# EAGLE design WalkerStalkerv3.0 (EAGLE 7.2.0)
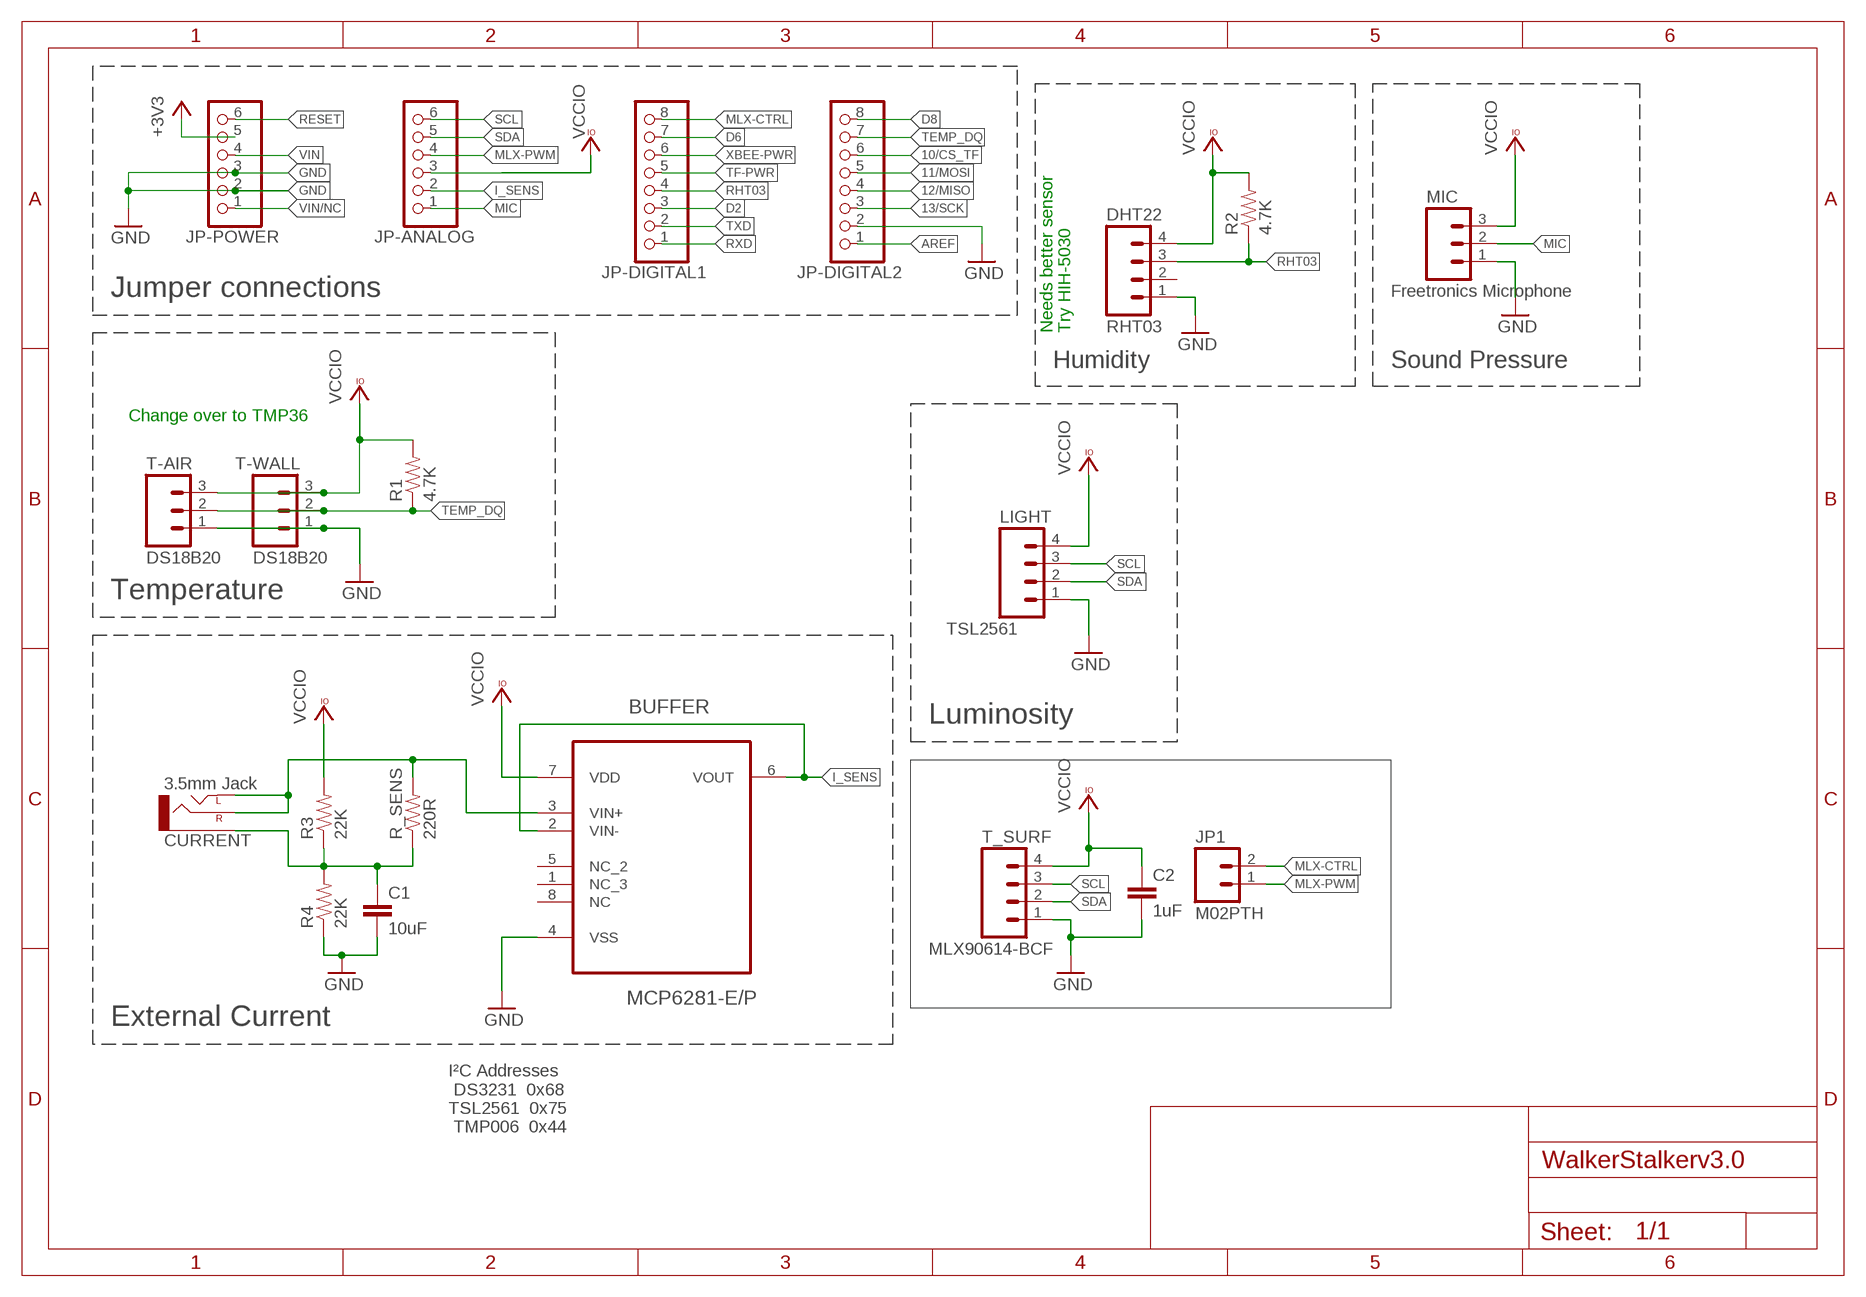
[diagram p0: schematic, sheet 1, part 1 of 2]
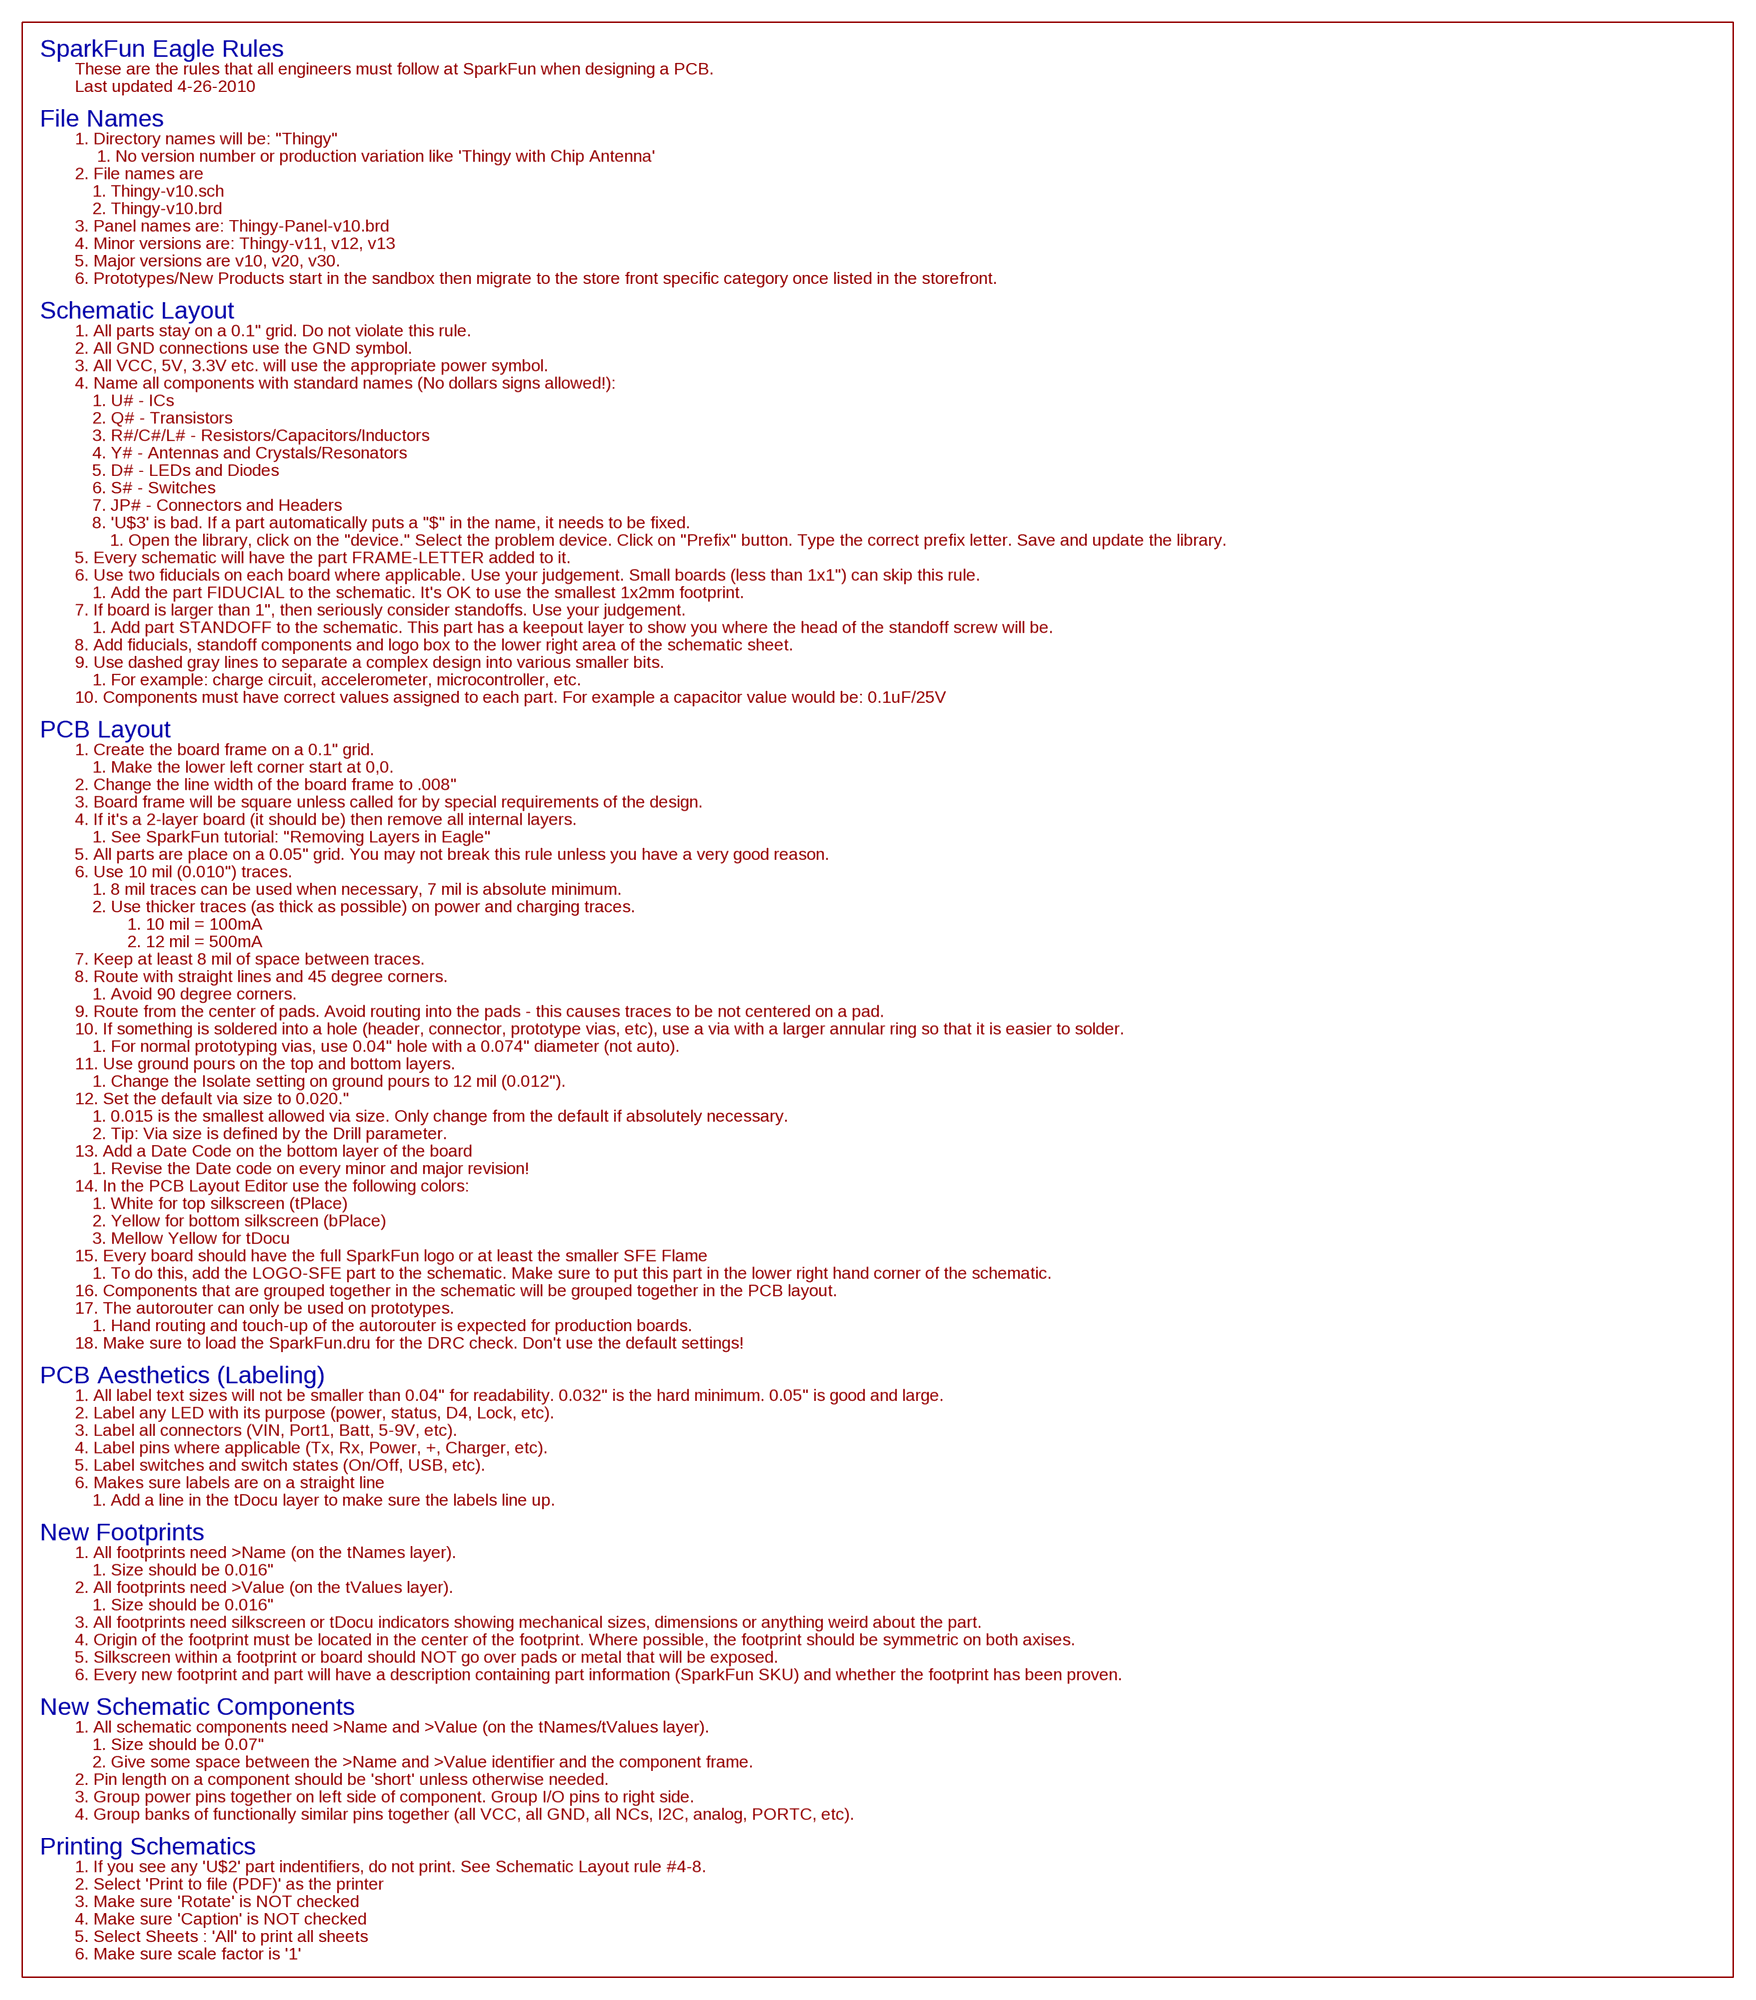
[diagram p1: schematic, sheet 1, part 2 of 2]

## Parts
BUFFER  MCP6281-E/P  [DIP254P762X432-8]
C1  10uF  CAP1206  [1206]
C2  1uF  CAP1206  [1206]
CURRENT  3.5mm Jack  AUDIO-JACKPTH  [AUDIO-JACK]
DHT22  RHT03  M04PTH  [1X04]
JP1  M02PTH  [1X02]
JP-ANALOG  PINHD-1X6CB  [1X06-CLEANBIG]
JP-DIGITAL1  PINHD-1X8CLEANBIG  [1X08-CLEANBIG]
JP-DIGITAL2  PINHD-1X8CLEANBIG  [1X08-CLEANBIG]
JP-POWER  PINHD-1X6CB  [1X06-CLEANBIG]
LIGHT  TSL2561  M04PTH  [1X04]
MIC  Freetronics Microphone  M03PTH  [1X03]
R1  4.7K  RESISTOR1206  [1206]
R2  4.7K  RESISTOR1206  [1206]
R3  22K  RESISTOR1206  [1206]
R4  22K  RESISTOR1206  [1206]
R_SENS  220R  RESISTOR1206  [1206]
T-AIR  DS18B20  M03PTH  [1X03]
T-WALL  DS18B20  M03PTH  [1X03]
T_SURF  MLX90614-BCF  M04PTH  [1X04]

## Nets
10/CS_TF: JP-DIGITAL2.6
11/MOSI: JP-DIGITAL2.5
12/MISO: JP-DIGITAL2.4
13/SCK: JP-DIGITAL2.3
+3V3: JP-POWER.5
AREF: JP-DIGITAL2.1
D2: JP-DIGITAL1.3
D6: JP-DIGITAL1.7
D8: JP-DIGITAL2.8
GND: BUFFER.4(VSS) C1.2 C2.2 DHT22.1 JP-DIGITAL2.2 JP-POWER.2 JP-POWER.3 LIGHT.1 MIC.1 R4.1 T-AIR.1 T-WALL.1 T_SURF.1
I_SENS: BUFFER.2(VIN-) BUFFER.6(VOUT) JP-ANALOG.2
MIC: JP-ANALOG.1 MIC.2
MLX-CTRL: JP1.2 JP-DIGITAL1.8
MLX-PWM: JP1.1 JP-ANALOG.4
N$1: BUFFER.3(VIN+) CURRENT.RING(RIGHT) CURRENT.TIP(LEFT) R_SENS.2
N$2: C1.1 CURRENT.SLEEVE R3.1 R4.2 R_SENS.1
RESET: JP-POWER.6
RHT03: DHT22.3 JP-DIGITAL1.4 R2.1
RXD: JP-DIGITAL1.1
SCL: JP-ANALOG.6 LIGHT.3 T_SURF.3
SDA: JP-ANALOG.5 LIGHT.2 T_SURF.2
TEMP_DQ: JP-DIGITAL2.7 R1.1 T-AIR.2 T-WALL.2
TF-PWR: JP-DIGITAL1.5
TXD: JP-DIGITAL1.2
VCCIO: BUFFER.7(VDD) C2.1 DHT22.4 JP-ANALOG.3 LIGHT.4 MIC.3 R1.2 R2.2 R3.2 T-AIR.3 T-WALL.3 T_SURF.4
VIN: JP-POWER.4
VIN/NC: JP-POWER.1
XBEE-PWR: JP-DIGITAL1.6
Unconnected: BUFFER.1(NC_3) BUFFER.5(NC_2) BUFFER.8(NC) DHT22.2

## Notes on the sheet
- Jumper connections
- Needs better sensor | Try HIH-5030
- Humidity | Sound Pressure
- Change over to TMP36
- Temperature
- Luminosity
- External Current
- I²C Addresses 
   DS3231  0x68
  TSL2561  0x75
   TMP006  0x44

## Library data of the parts
BUFFER = Microchip_By_element14_Batch_1:MCP6281-E/P: Rail-to-Rail Op Amp; DESCRIPTION: OP AMP; MPN: MCP6281-E/P; OC_FARNELL: 1439456; OC_NEWARK: -; PACKAGE: DIP-8; SUPPLIER: Microchip
C1 C2 = SparkFun-Capacitors:CAP: Capacitor Standard 0603 ceramic capacitor, and 0.1" leaded capacitor.
CURRENT = SparkFun-Connectors:AUDIO-JACK: 3.5mm Audio Jack Simple 3.5mm common PCB mount audio jack. SKU: PRT-08032
DHT22 LIGHT T_SURF = SparkFun-Connectors:M04: Header 4 Standard 4-pin 0.1" header. Use with straight break away headers (SKU : PRT-00116), right angle break away headers (PRT-00553), swiss pins (PRT-00743), machine pins (PRT-00117), and female headers (PRT-00115). Molex polarized connector foot print use with SKU : PRT-08231 with associated crimp pins and housings. 1MM SMD Version SKU: PRT-10208
JP1 = SparkFun-Connectors:M02: Standard 2-pin 0.1" header. Use with - straight break away headers ( PRT-00116) - right angle break away headers (PRT-00553) - swiss pins (PRT-00743) - machine pins (PRT-00117) - female headers (PRT-00115) Molex polarized connector foot print use with: PRT-08233 with associated crimp pins and housings. 2.54_SCREWTERM for use with PRT-10571. 3.5mm Screw Terminal footprints for PRT-08084 5mm Screw Terminal footprints for use with PRT-08432
JP-ANALOG JP-POWER = carduino:PINHD-1X6: PIN HEADER
JP-DIGITAL1 JP-DIGITAL2 = carduino:PINHD-1X8: PIN HEADER
MIC T-AIR T-WALL = SparkFun-Connectors:M03: Header 3 Standard 3-pin 0.1" header. Use with straight break away headers (SKU : PRT-00116), right angle break away headers (PRT-00553), swiss pins (PRT-00743), machine pins (PRT-00117), and female headers (PRT-00115). Molex polarized connector foot print use with SKU : PRT-08232 with associated crimp pins and housings.
R1-R4 R_SENS = SparkFun-Resistors:RESISTOR: Resistor Basic schematic elements and footprints for 0603, 1206, and PTH resistors.

## Board
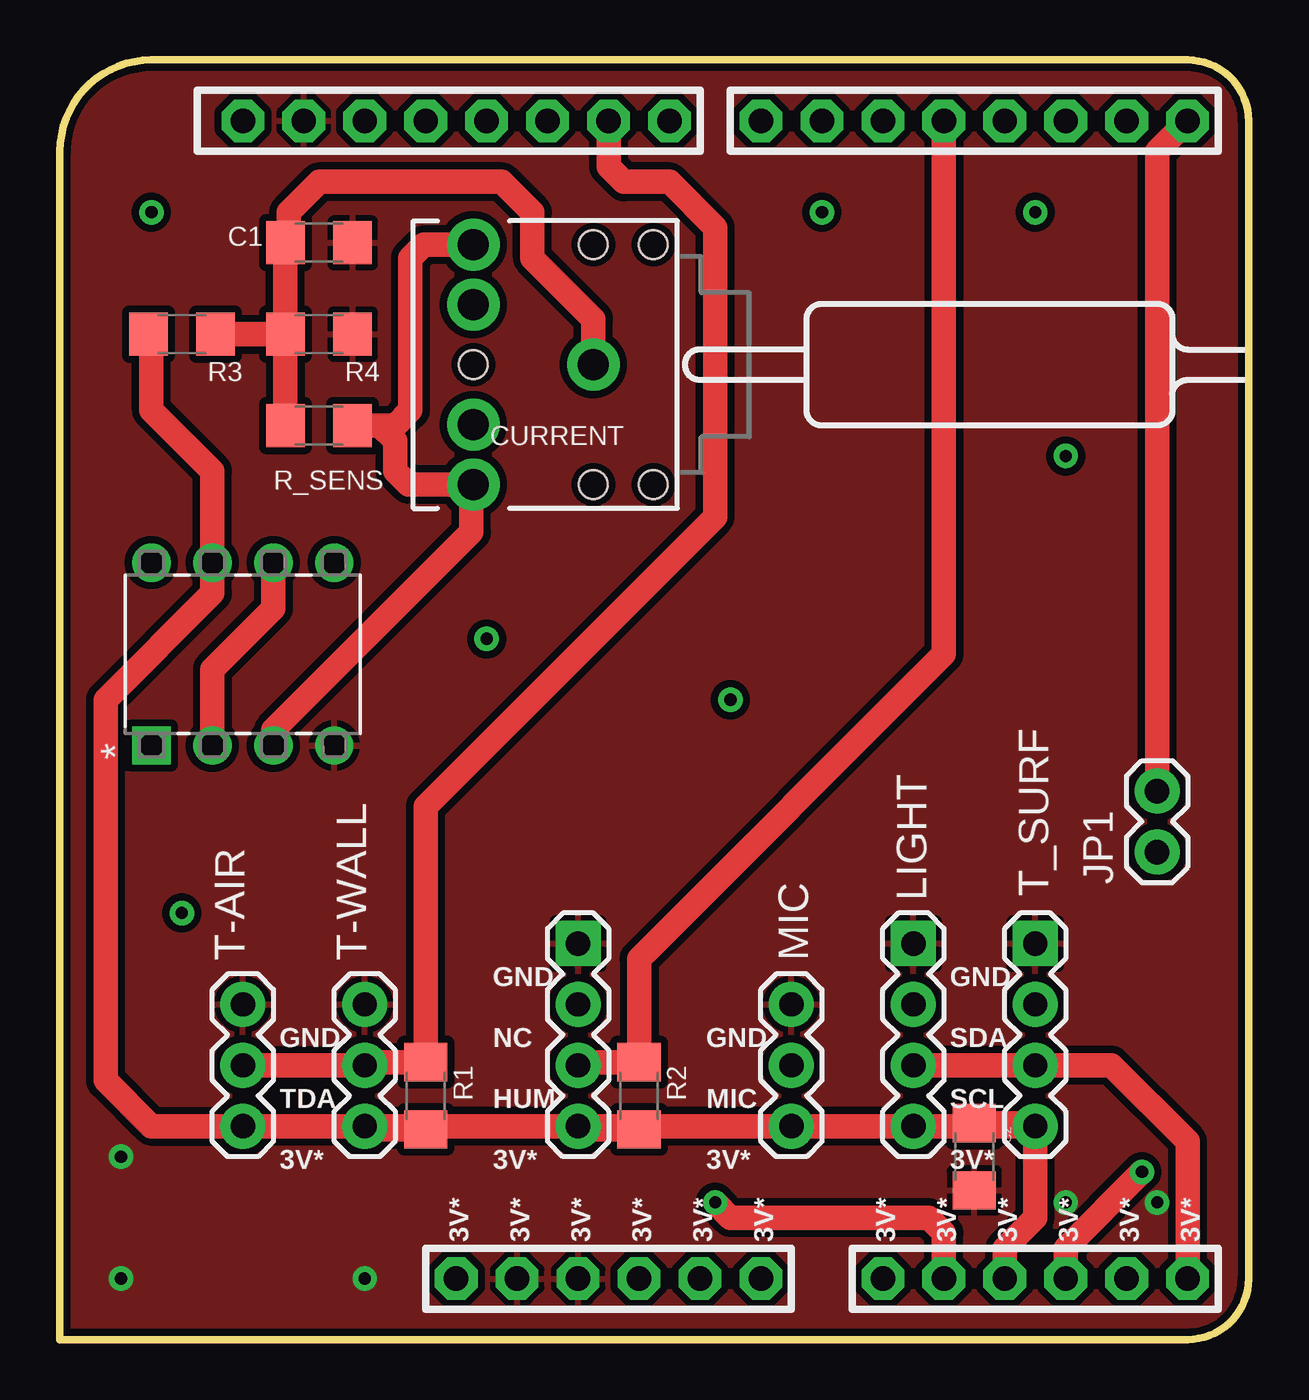
[diagram p2: board, top side]
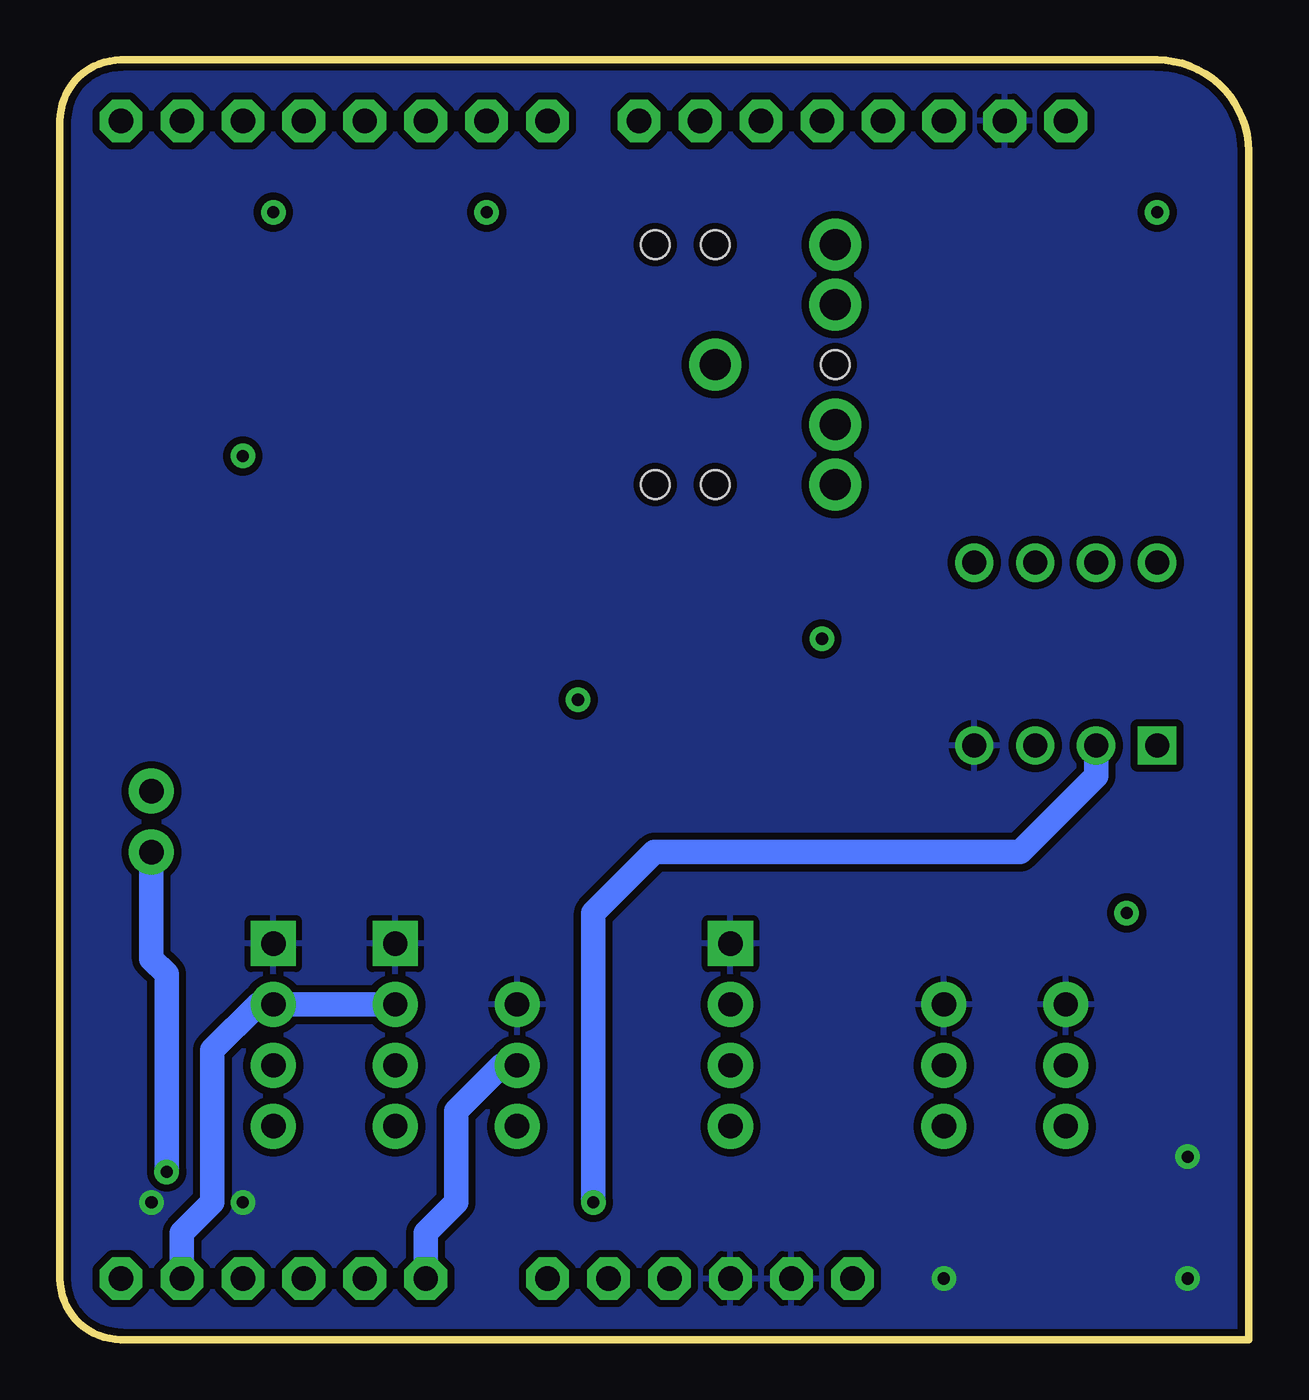
[diagram p3: board, bottom side, seen from below]

Size 49.53 x 53.34 mm. Coordinates in mm from the lower left corner, seen from the top.
Outline: 0,0 0,49.53 arc-90 3.81,53.34 46.99,53.34 arc-90 49.53,50.8 49.53,2.54 arc-90 46.99,0 0,0
Copper layers (1*16): Top 0.035mm / dielectric 1.5mm / Bottom 0.035mm
Design rules "SparkFun-2-layer": minimum track width 7mil, minimum drill 15mil, track to track 8mil, track to pad 8mil, pad to pad 8mil, via to via 8mil, smd to smd 8mil, copper to edge 8mil, drill to drill 8mil, minimum pad ring 12mil, minimum via ring 10mil, stop-mask expansion 4mil, vias tented up to drill 20mil, thermal gap 10mil

### Footprints (pad centres in the part's own frame; a part is rotated, then mirrored left to right if it is on the bottom)
DIP254P762X432-8 = drill 0.991 square: 1 -7.62,7.62 | drill 0.991: 2 -7.62,5.08; 3 -7.62,2.54; 4 -7.62,0; 5 0,0; 6 0,2.54; 7 0,5.08; 8 0,7.62
1206 = smd 1.6 x 1.8: 1 -1.4,0; 2 1.4,0
AUDIO-JACK = drill 1.3 pad 2.184: RING 5,5; RSH 5,2.5; SLEEVE 0,0; TIP 5,-5; TSH 5,-2.5 | hole 1.2: 0,5; -2.5,5; -2.5,-5; 0,-5; 5,0
1X04 = drill 1.016 pad 1.88 square: 1 0,0 | drill 1.016 pad 1.88: 2 2.54,0; 3 5.08,0; 4 7.62,0
1X02 = drill 1.016 pad 1.88: 1 0,0; 2 2.54,0
1X06-CLEANBIG = drill 1.016 pad 1.778 octagon: 1 -6.35,0; 2 -3.81,0; 3 -1.27,0; 4 1.27,0; 5 3.81,0; 6 6.35,0
1X08-CLEANBIG = drill 1.016 pad 1.778 octagon: 1 -8.89,0; 2 -6.35,0; 3 -3.81,0; 4 -1.27,0; 5 1.27,0; 6 3.81,0; 7 6.35,0; 8 8.89,0
1X03 = drill 1.016 pad 1.88: 1 0,0; 2 2.54,0; 3 5.08,0

### Placement (x,y rotation side)
BUFFER  11.43,32.38 90 top
C1  10.79,45.72 0 top
C2  38.1,7.62 270 top
CURRENT  22.23,40.64 180 top
DHT22  21.59,16.51 270 top
JP1  45.72,20.32 90 top
JP-ANALOG  40.64,2.54 0 top
JP-DIGITAL1  38.1,50.8 0 top
JP-DIGITAL2  16.51,50.8 0 top
JP-POWER  22.86,2.54 0 top
LIGHT  35.56,16.51 270 top
MIC  30.48,13.97 270 top
R1  15.24,10.16 270 top
R2  24.13,10.16 270 top
R3  5.08,41.91 180 top
R4  10.79,41.91 180 top
R_SENS  10.79,38.1 0 top
T-AIR  7.62,13.97 270 top
T-WALL  12.7,13.97 270 top
T_SURF  40.64,16.51 270 top

### Tracks (layer width: path | path; a pad name or v marks a point on that pad's centre or on a via)
GND  (via drill 0.51)
  other vias: 2.54,7.62 2.54,2.54 12.7,2.54 45.72,5.71 41.91,5.71
  pour Top (isolate 0.305): 0,49.53 arc-90 3.81,53.34 46.99,53.34 arc-90 49.53,50.8 49.53,2.54 arc-90 46.99,0 3.81,0 arc90 3.17,-0.64 3.17,-1.27 arc-90 2.54,-1.91 arc-90 1.91,-1.27 1.91,-0.64 arc90 1.27,0 0,0
  pour Bottom (isolate 0.305): 0,0 0,49.53 arc-90 3.81,53.34 46.99,53.34 arc-90 49.53,50.8 49.53,2.54 arc-90 46.99,0 1.91,0 arc90 1.27,-0.64 1.27,-1.27 arc-90 0.64,-1.91 arc-90 0,-1.27
I_SENS  (via drill 0.51)
  Top 1.016: BUFFER.6 8.89,30.48 6.35,27.94 BUFFER.2 | JP-ANALOG.2 36.83,4.45 36.2,5.08 27.94,5.08 v27.3,5.71
  Bottom 1.016: v27.3,5.71 27.3,17.78 24.77,20.32 9.53,20.32 6.35,23.5 BUFFER.2
MIC
  Bottom 1.016: JP-ANALOG.1 34.29,4.45 33.02,5.71 33.02,9.53 31.11,11.43 MIC.2
MLX-CTRL
  Top 1.016: JP1.2 45.72,49.53 JP-DIGITAL1.8
MLX-PWM  (via drill 0.51)
  Top 1.016: JP-ANALOG.4 41.91,3.81 v45.09,6.99
  Bottom 1.016: v45.09,6.99 45.09,15.24 45.72,15.88 JP1.1
N$1
  Top 1.016: CURRENT.TIP 15.16,45.64 14.61,45.09 14.61,38.73 13.97,38.1 13.34,38.1 | 13.34,38.1 R_SENS.2 | 13.34,38.1 13.97,37.47 13.97,36.2 14.53,35.64 CURRENT.RING 17.14,35.56 17.14,33.66 8.89,25.4 BUFFER.3
N$2
  Top 1.016: R3.1 R4.2 | R4.2 C1.1 9.53,45.85 9.53,46.99 10.79,48.26 18.41,48.26 19.68,46.99 19.68,45.09 22.23,42.55 CURRENT.SLEEVE | R4.2 R_SENS.1
N$3  (via drill 0.51)
  other vias: 27.94,26.67
N$4  (via drill 0.51)
  other vias: 17.78,29.21
N$5  (via drill 0.51)
  other vias: 41.91,36.83
N$6  (via drill 0.51)
  other vias: 31.75,46.99
N$7  (via drill 0.51)
  other vias: 40.64,46.99
N$8  (via drill 0.51)
  other vias: 3.81,46.99
N$9  (via drill 0.51)
  other vias: 5.08,17.78
RHT03
  Top 1.016: JP-DIGITAL1.4 36.83,28.57 24.13,15.88 R2.1 | 22.99,11.56 R2.1 | DHT22.3 21.72,11.56 R2.1
SCL
  Top 1.016: LIGHT.3 T_SURF.3 43.81,11.43 46.99,8.26 JP-ANALOG.6
SDA
  Bottom 1.016: LIGHT.2 T_SURF.2 41.27,13.97 43.18,12.06 43.18,5.71 44.45,4.45 JP-ANALOG.5
TEMP_DQ
  Top 1.016: JP-DIGITAL2.7 22.86,48.9 23.5,48.26 25.4,48.26 27.3,46.35 27.3,34.29 15.24,22.23 R1.1 12.83,11.56 T-WALL.2 T-AIR.2
VCCIO
  Top 1.016: JP-ANALOG.3 39.37,3.81 40.64,5.08 T_SURF.4 | T_SURF.4 LIGHT.4 MIC.3 DHT22.4 | DHT22.4 T-WALL.3 | T-WALL.3 T-AIR.3 3.81,8.89 1.91,10.79 1.91,26.67 6.35,31.11 BUFFER.7 6.35,36.2 3.81,38.73 3.81,41.78 R3.2 | T-WALL.3 12.83,8.76 R1.2 | DHT22.4 21.72,8.76 R2.2 | T_SURF.4 40.51,9.02 C2.1

### Text on the board
tNames: GND | GND | GND | NC | GND | SDA | TDA | HUM | MIC | SCL | 3V* | 3V* | 3V* | 3V* | 3V* | 3V* | 3V* | 3V* | 3V* | 3V* | 3V* | 3V* | 3V* | 3V* | 3V* | 3V*